# Altium project BFMC_ProcessingAllBoard.PrjPcb (part 1 of 2)
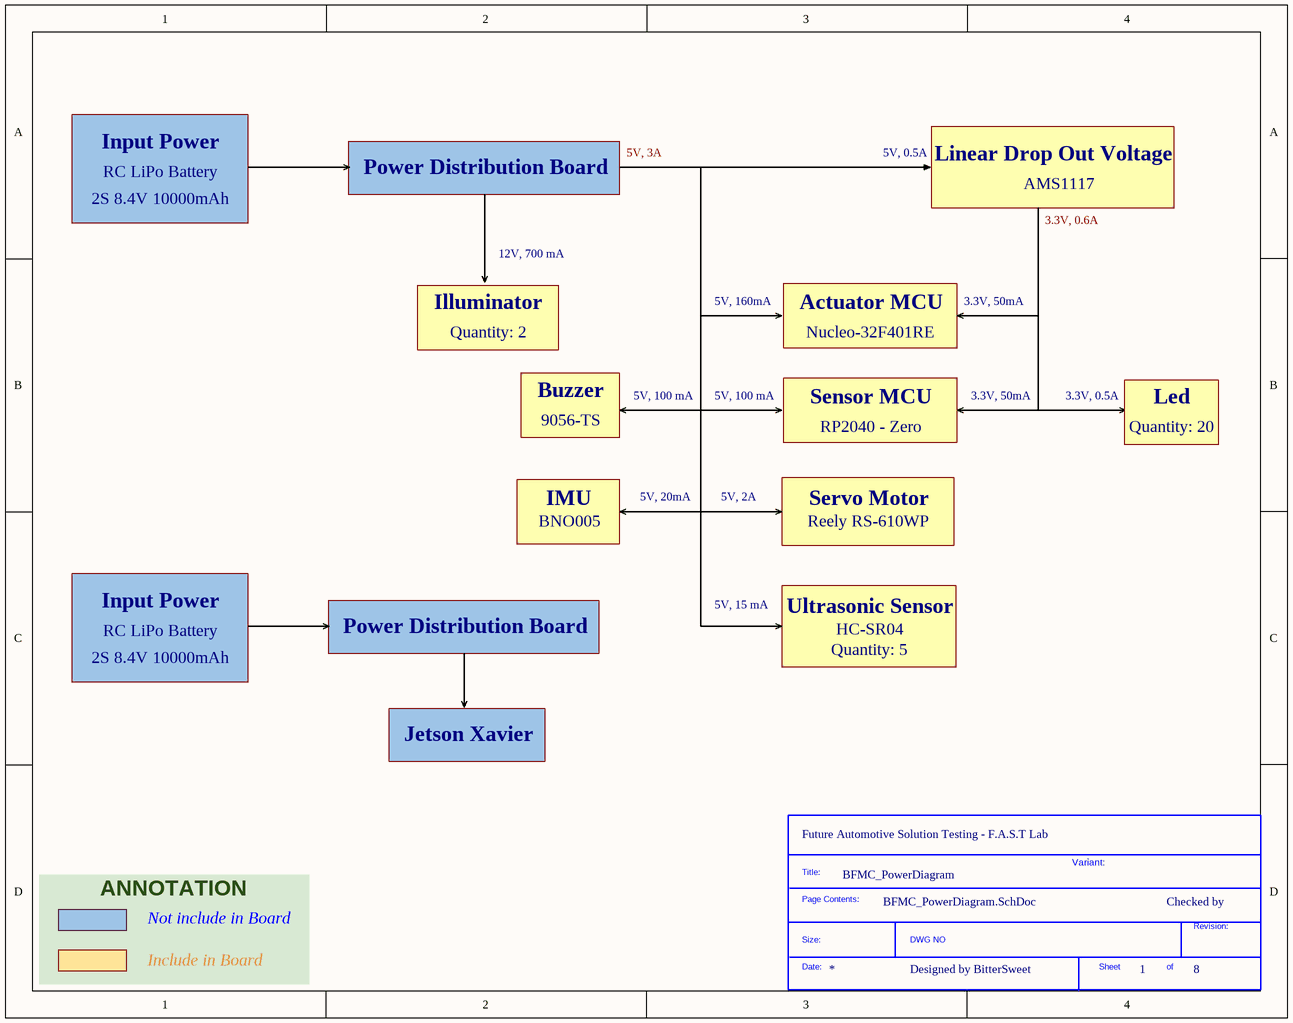
[diagram p0: BFMC_PowerDiagram.SchDoc]
7 sheets, 102 parts. Net scope: flat (ports and power ports of the same name join across sheets).
Board file: BFMC_ProcessingAllBoard.PcbDoc
Sheets:
  BFMC_PowerDiagram.SchDoc
  BFMC_SignalDiagram.SchDoc
  BFMC_FileInfo.SchDoc
  BFMC_PowerDistribution.SchDoc
  BFMC_Microcontrollers.SchDoc
  BFMC_SensorProcessing.SchDoc
  BFMC_Actuators.SchDoc

## Sheet BFMC_PowerDiagram.SchDoc
size A; SheetNumber: 1; SheetTotal: 8

### Parts
(Parts that share a designator on the sheet are numbered #1, #2 ... from top to bottom, then left to right.)
*?#1  SDTitleBlock  (value not drawn)  (graphical)

### Notes on the sheet
- Input Power
- 5V, 3A
- 5V, 0.5A
- Linear Drop Out Voltage
- 2S 8.4V 10000mAh
- RC LiPo Battery
- Power Distribution Board
- AMS1117
- 3.3V, 0.6A
- 12V, 700 mA
- Illuminator
- Quantity: 2
- 5V, 160mA
- Actuator MCU
- Nucleo-32F401RE
- 3.3V, 50mA
- Buzzer
- 9056-TS
- 5V, 100 mA
- Sensor MCU
- RP2040 - Zero
- 3.3V, 0.5A
- Quantity: 20
- Led
- IMU
- 5V, 20mA
- 5V, 2A
- Servo Motor
- BNO005
- Reely RS-610WP
- 5V, 15 mA
- Ultrasonic Sensor
- HC-SR04
- Quantity: 5
- Jetson Xavier
- (near *?#1) Future Automotive Solution Testing - F.A.S.T Lab
- BFMC_PowerDiagram
- Variant:
- Checked by
- Not include in Board
- Include in Board
- Designed by BitterSweet
- ANNOTATION
- (in symbol SDTitleBlock) Title:; Page Contents:; Revision:; Size:; DWG NO; Date:; Sheet; of

## Sheet BFMC_SignalDiagram.SchDoc
size A; SheetNumber: 2; SheetTotal: 8
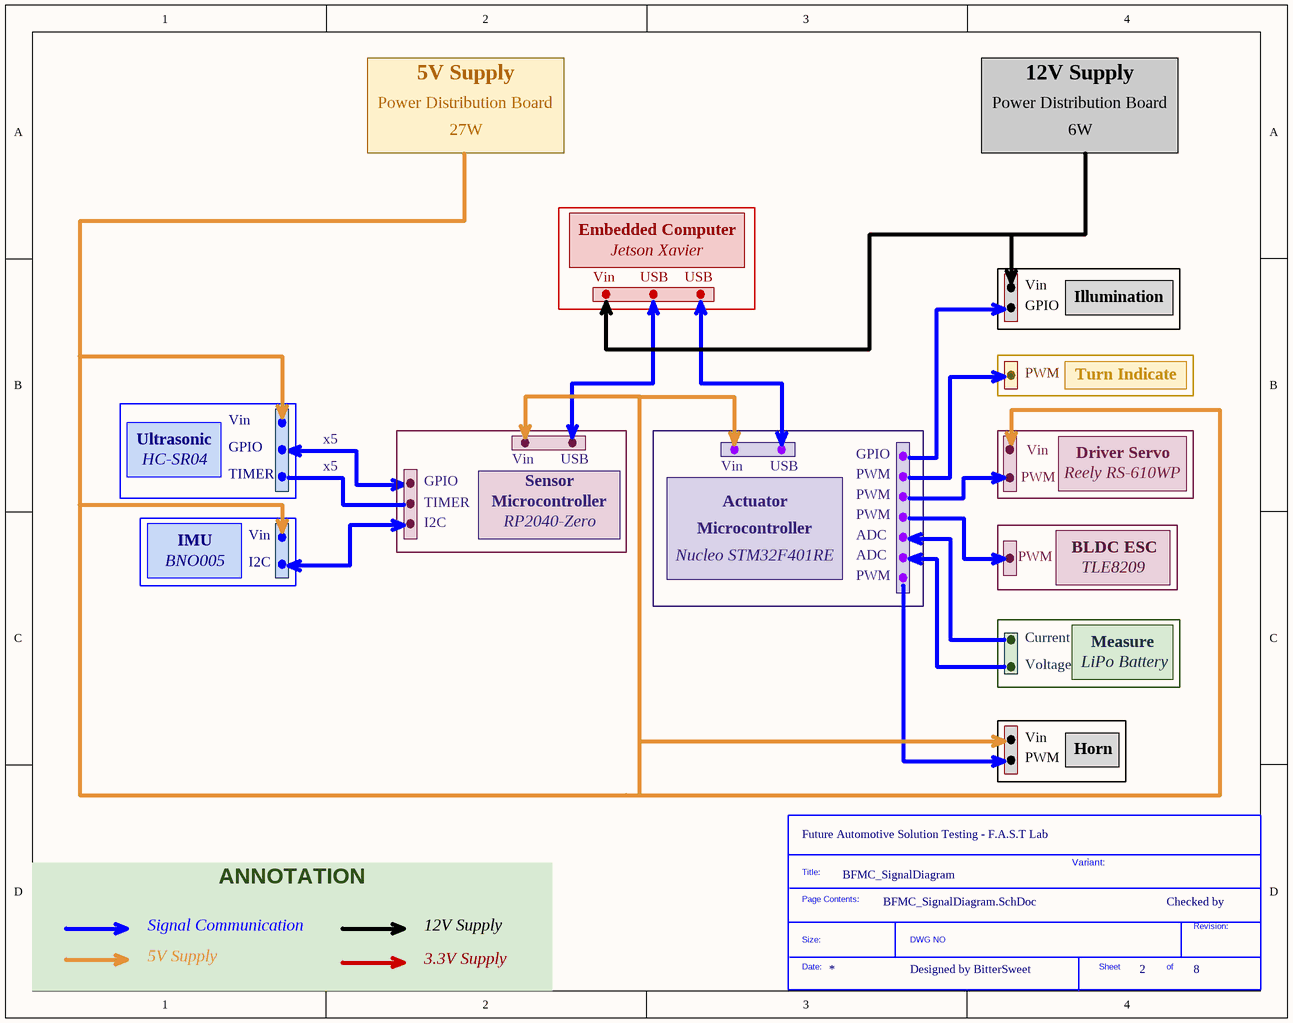
[diagram p1: BFMC_SignalDiagram.SchDoc]

### Parts
(Parts that share a designator on the sheet are numbered #1, #2 ... from top to bottom, then left to right.)
*?#2  SDTitleBlock  (value not drawn)  (graphical)

### Notes on the sheet
- 5V Supply
- 12V Supply
- Power Distribution Board
- 27W
- 6W
- Embedded Computer
- Vin
- Jetson Xavier
- USB
- Illumination
- GPIO
- PWM
- Turn Indicate
- Ultrasonic
- HC-SR04
- TIMER
- x5
- Microcontroller
- Sensor
- Actuator
- Reely RS-610WP
- Driver Servo
- BNO005
- IMU
- I2C
- RP2040-Zero
- Nucleo STM32F401RE
- ADC
- BLDC ESC
- TLE8209
- Current
- Voltage
- LiPo Battery
- Measure
- Horn
- (near *?#2) Future Automotive Solution Testing - F.A.S.T Lab
- BFMC_SignalDiagram
- Variant:
- Checked by
- Signal Communication
- 3.3V Supply
- Designed by BitterSweet
- ANNOTATION
- (in symbol SDTitleBlock) Title:; Page Contents:; Revision:; Size:; DWG NO; Date:; Sheet; of

## Sheet BFMC_FileInfo.SchDoc
size A; SheetNumber: 3; SheetTotal: 7
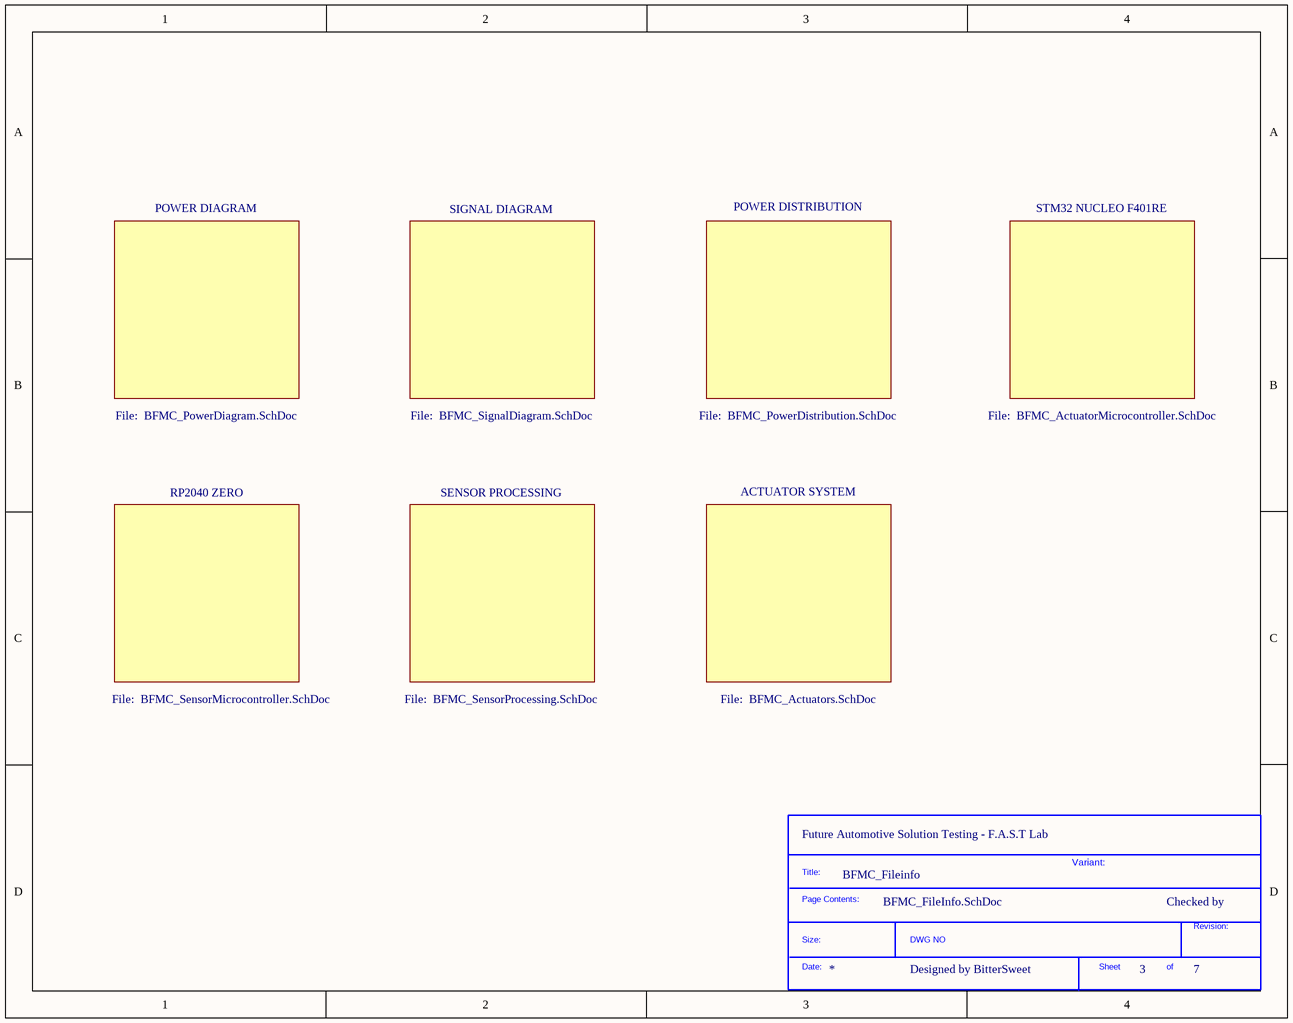
[diagram p2: BFMC_FileInfo.SchDoc]

### Parts
(Parts that share a designator on the sheet are numbered #1, #2 ... from top to bottom, then left to right.)
*?#3  SDTitleBlock  (value not drawn)  (graphical)

### Notes on the sheet
- POWER DIAGRAM
- SIGNAL DIAGRAM
- POWER DISTRIBUTION
- STM32 NUCLEO F401RE
- File:  BFMC_PowerDiagram.SchDoc
- File:  BFMC_SignalDiagram.SchDoc
- File:  BFMC_PowerDistribution.SchDoc
- File:  BFMC_ActuatorMicrocontroller.SchDoc
- RP2040 ZERO
- SENSOR PROCESSING
- ACTUATOR SYSTEM
- File:  BFMC_SensorMicrocontroller.SchDoc
- File:  BFMC_SensorProcessing.SchDoc
- File:  BFMC_Actuators.SchDoc
- (near *?#3) Future Automotive Solution Testing - F.A.S.T Lab
- BFMC_Fileinfo
- Variant:
- Checked by
- Designed by BitterSweet
- (in symbol SDTitleBlock) Title:; Page Contents:; Revision:; Size:; DWG NO; Date:; Sheet; of

## Sheet BFMC_PowerDistribution.SchDoc
size A; SheetNumber: 4; SheetTotal: 7
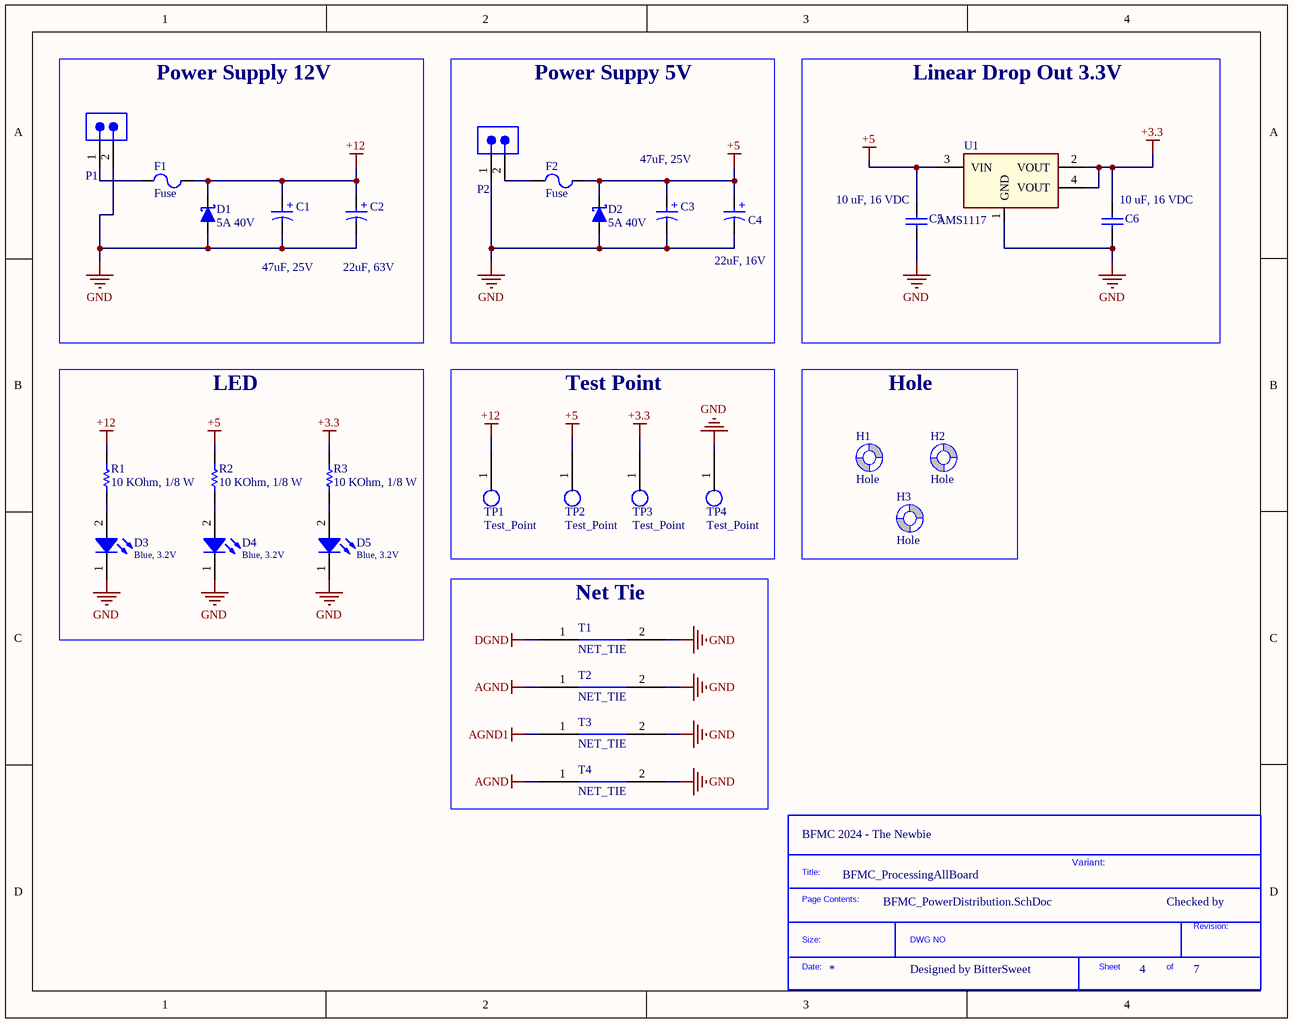
[diagram p3: BFMC_PowerDistribution.SchDoc]

### Parts
(Parts that share a designator on the sheet are numbered #1, #2 ... from top to bottom, then left to right.)
*?#4  SDTitleBlock  (value not drawn)  (graphical)
C1  47uF, 25V  [WCAP-ASLI_D6.3H5.5]
C2  22uF, 63V  [WCAP-ASLI_D6.3H7.7]
C3  47uF, 25V  [WCAP-ASLI_D6.3H5.5]
C4  22uF, 16V  [WCAP-ASLI_D4H5.5]
C5  10 uF, 16 VDC  [CAP_0805]
C6  10 uF, 16 VDC  [CAP_0805]
D1  5A 40V  [DO-214AB, SMA]
D2  5A 40V  [DO-214AB, SMA]
D3  Blue, 3.2V  [WL-SMCW_0805]
D4  Blue, 3.2V  [WL-SMCW_0805]
D5  Blue, 3.2V  [WL-SMCW_0805]
F1  Fuse  [FuseHolder1808]
F2  Fuse  [FuseHolder1808]
H1  Hole  [Hole_3.2mm]
H2  Hole  [Hole_3.2mm]
H3  Hole  [HOLE_RECTANGLE]
P1  10A, 300V  [691322310002]  (value not drawn)
P2  10A, 300V  [691322310002]  (value not drawn)
R1  10 KOhm, 1/8 W  [RESISTOR_0805]
R2  10 KOhm, 1/8 W  [RESISTOR_0805]
R3  10 KOhm, 1/8 W  [RESISTOR_0805]
T1  NET_TIE  [NET_TIE_2.0mm]
T2  NET_TIE  [NET_TIE_0.5MM]
T3  NET_TIE  [NET_TIE_0.5MM]
T4  NET_TIE  [NET_TIE_0.5MM]
TP1  Test_Point  [TP_1_5mm_SMD]
TP2  Test_Point  [TP_1_5mm_SMD]
TP3  Test_Point  [TP_1_5mm_SMD]
TP4  Test_Point  [TP_1_5mm_SMD]
U1  AMS1117  [AMS1117]

### Blocks framed on the sheet
Power Supply 12V: C1 C2 D1 F1 P1
Power Suppy 5V: C3 C4 D2 F2 P2
Linear Drop Out 3.3V: C5 C6 U1
LED: D3-D5 R1-R3
Test Point: TP1-TP4
Hole: H1-H3
Net Tie: T1-T4

### Nets
+3.3: C6.2 R3.1 TP3.1 U1.2(VOUT) U1.4(VOUT)
+5: C3.1(P) C4.1(P) C5.2 D2.2(K) F2.2 R2.1 TP2.1 U1.3(VIN)
+12: C1.1(P) C2.1(P) D1.2(K) F1.2 R1.1 TP1.1
AGND: T2.1 T4.1
AGND1: T3.1
DGND: T1.1
GND: C1.2(N) C2.2(N) C3.2(N) C4.2(N) C5.1 C6.1 D1.1(A) D2.1(A) D3.1(K) D4.1(K) D5.1(K) P1.2 P2.1 T1.2 T2.2 T3.2 T4.2 TP4.1 U1.1(GND)
NetD3_2: D3.2(A) R1.2
NetD4_2: D4.2(A) R2.2
NetD5_2: D5.2(A) R3.2
NetF1_1: F1.1 P1.1
NetF2_1: F2.1 P2.2

Not connected (* = marked no-connect by the designer): H1 1(Screw); H2 1(Screw); H3 1(Screw)

### Notes on the sheet
- (near *?#4) BFMC 2024 - The Newbie
- BFMC_ProcessingAllBoard
- Variant:
- Checked by
- Designed by BitterSweet
- (in symbol 865080340003) +
- (in symbol 865080443007) +
- (in symbol 865080745011) +
- (in symbol SDTitleBlock) Title:; Page Contents:; Revision:; Size:; DWG NO; Date:; Sheet; of

### Library data of the parts
C1 C3 = 865080443007: V-Chip, D6.3 x H5.5mm, 47uF, 25V; Manufacturer: Wurth Elektronik; Capacitance Tolerance: +/-20%; Dissipation Factor: 14%; Endurance: 2000h; Leakage Current: 11.75uA; Ripple Current: 220mA; Category: Aluminum Electrolytic Capacitors; ComponentLink2Description: Datasheet Link; ComponentLink2URL: https://www.we-online.com/redexpert/spec/865080443007?ad; Mount: Surface Mount; Operating Temperature Max: 105°C; Operating Temperature Min: -55°C; Packaging: Tape and Reel; Height: 5.5mm; Diameter: 6.3mm; Capacitance: 47uF; Rated Voltage (DC): 25V; Supplier 1 Name: Mouser; Supplier 1 SN: 710-865080443007; Supplier 1 URL: https://www.mouser.com/ProductDetail/Wurth-Elektronik/865080443007?qs=0KOYDY2FL29hh2FHnT7VZA%3D%3D; Supplier 3 Name: thegioiic; Supplier 3 URL: https://www.thegioiic.com/tu-nhom-smd-47uf-25v-6-3x5-4mm; Manufacturer Part Number: N/A; Supplier 2 Name: Digi-Key; Supplier 2 SN: N/A; Supplier 2 URL: N/A; Supplier 3 SN: N/A; Value: 47uF, 25V
C2 = 865080745011: V-Chip, D6.3 x H7.7mm, 22uF, 63V; Manufacturer: Wurth Elektronik; Capacitance Tolerance: +/-20%; Dissipation Factor: 12%; Endurance: 2000h; Leakage Current: 13.86uA; Ripple Current: 58mA; Category: Aluminum Electrolytic Capacitors; ComponentLink2Description: Datasheet Link; ComponentLink2URL: https://www.we-online.com/redexpert/spec/865080745011?ad; Mount: Surface Mount; Operating Temperature Max: 105°C; Operating Temperature Min: -55°C; Packaging: Tape and Reel; Height: 7.7mm; Diameter: 6.3mm; Capacitance: 22uF; Rated Voltage (DC): 63V; Supplier 1 Name: Mouser; Supplier 1 SN: 710-865080745011; Supplier 1 URL: https://www.mouser.vn/ProductDetail/Wurth-Elektronik/865080745011?qs=amGC7iS6iy%2FPRPUkpVJ4xg%3D%3D; Supplier 3 Name: thegioiic; Supplier 3 URL: https://www.thegioiic.com/tu-nhom-smd-22uf-63v-6-3x7-7mm; Manufacturer Part Number: N/A; Supplier 2 Name: Digi-Key; Supplier 2 SN: N/A; Supplier 2 URL: N/A; Supplier 3 SN: N/A; Value: 22uF, 63V
C4 = 865080340003: V-Chip, D4 x H5.5mm, 22uF, 16V; Manufacturer: Wurth Elektronik; Capacitance Tolerance: +/-20%; Dissipation Factor: 16%; Endurance: 2000h; Leakage Current: 3.52uA; Ripple Current: 90mA; Category: Aluminum Electrolytic Capacitors; ComponentLink2Description: Datasheet Link; ComponentLink2URL: https://www.we-online.com/redexpert/spec/865080340003?ad; Mount: Surface Mount; Operating Temperature Max: 105°C; Operating Temperature Min: -55°C; Packaging: Tape and Reel; Height: 5.5mm; Diameter: 4mm; Capacitance: 22uF; Rated Voltage (DC): 16V; Supplier 1 Name: Mouser; Supplier 1 SN: 710-865080340003; Supplier 1 URL: https://www.mouser.com/ProductDetail/Wurth-Elektronik/865080340003?qs=0KOYDY2FL2%252BowmC4S50IuQ%3D%3D; Supplier 3 Name: thegioiic; Supplier 3 URL: https://www.thegioiic.com/tu-nhom-smd-22uf-16v-4x5-4mm; Manufacturer Part Number: N/A; Supplier 2 Name: Digi-Key; Supplier 2 SN: N/A; Supplier 2 URL: N/A; Supplier 3 SN: N/A; Value: 22uF, 16V
C5 C6 = 0108051061016: CAP, size 0805, 10 uF, 16 VDC; Manufacture Name: TDK; Manufacture SN: CGA4J1X7S1C106K125AE; Capacitance: 10 uF; Tolerance: +/-10%; Voltage Rating DC: 16 VDC; ComponentLink2Description: Datasheet; ComponentLink2URL: https://product.tdk.com/system/files/dam/doc/product/capacitor/ceramic/mlcc/catalog/mlcc_automotive_soft_en.pdf?ref_disty=mouser; Operating Temperature: -55 to +125degC; Packaging: Tape and Reel; Mounting Technology: SMT; Size: 0805; Supplier 1 Name: Mouser; Supplier 1 SN: 810-CGA4J1X7S1C106KA; Supplier 1 URL: https://www.mouser.vn/ProductDetail/TDK/CGA4J1X7S1C106K125AE?qs=nQSIdc08i%252Bda5YDbrVYncg%3D%3D&utm_source=mouser-refine-download&utm_medium=file&utm_campaign=CGA4J1X7S1C106K125AE&utm_content=TDK; Supplier 2 Name: Digi-Key; Supplier 2 SN: 445-173674-2-ND; Supplier 2 URL: https://www.digikey.com/en/products/detail/tdk-corporation/cga4j1x7s1c106k125ae/5809239; Supplier 3 Name: thegioiic; Supplier 3 SN: OEM; Supplier 3 URL: https://www.thegioiic.com/tu-gom-0805-10uf-16v; Value: 10 uF, 16 VDC
D1 D2 = Diode_Schottky: SS54 SMC Diode Schottky 5A 40V; Supplier 3 URL: https://www.thegioiic.com/twgmc-ss34-sma-diode-schottky-3a
D3-D5 = 160805BlueBlur: WL-SMCW SMT Mono-color Chip LED Blur, size 0805, Blue, 3.2V, 140deg; Color: Blue; Size: 0603; Type: Blur; ComponentLink1Description: Datasheet link; ComponentLink1URL: N/A; ComponentLink2Description: Supplier 1 URL; ComponentLink2URL: https://www.mouser.vn/ProductDetail/Broadcom-Avago/HSMR-C170?qs=YDL0qNrpDT75U8LW5zK4Qg%3D%3D; ComponentLink3Description: Supplier 2 URL; ComponentLink3URL: https://www.digikey.com/en/products/detail/broadcom-limited/HSMR-C170/637706; ComponentLink4Description: Supplier 3 URL; ComponentLink4URL: N/A; Supplier 1 Name: Mouser; Supplier 1 SN: 630-HSMR-C170; Supplier 1 URL: https://www.mouser.vn/ProductDetail/Broadcom-Avago/HSMR-C170?qs=YDL0qNrpDT75U8LW5zK4Qg%3D%3D; Supplier 2 Name: Digi-Key; Supplier 2 SN: 516-1445-2-ND; Supplier 2 URL: https://www.digikey.com/en/products/detail/broadcom-limited/HSMR-C170/637706; Supplier 3 Name: ICDayRoi; Supplier 3 SN: N/A; Supplier 3 URL: https://www.thegioiic.com/led-xanh-la-0805-dan-smd-trong-suot-harvatek; Value: Blue, 3.2V
P1 P2 = 691322310002: WR-TBL Series 322 Horizontal PCB Header, THT, pitch 3.81mm, 2p; Manufacturer: Wurth Elektronik; Modularity: No; ComponentLink1Description: Datasheet Link; ComponentLink1URL: https://www.we-online.com/redexpert/spec/691322310002?ad; ComponentLink2Description: Supplier 1 URL; ComponentLink2URL: N/A; Manufacturer Part Number: 691322310002; Category: Terminal Blocks; Match Code: WR-TBL; Mount: Through Hole; Operating Temperature Max: 105°C; Operating Temperature Min: -40°C; Packaging: Box; Application: Pluggable; Number of Pins: 2; Number of Rows: 1; Orientation: Horizontal; Pitch: 3.81mm; Rated Current: 10A; Working Voltage: 300V; ComponentLink3Description: Supplier 2 URL; ComponentLink3URL: N/A; ComponentLink4Description: Supplier 3 URL; ComponentLink4URL: https://www.thegioiic.com/kf-3-81-2-r-terminal-block-plug-in-han-pcb-2-chan-cong-3-81mm-300v-10a; Supplier 1 Name: Mouser; Supplier 1 SN: N/A; Supplier 1 URL: N/A; Supplier 2 Name: Digi-Key; Supplier 2 SN: N/A; Supplier 2 URL: N/A; Supplier 3 Name: thegioiic; Supplier 3 SN: N/A; Supplier 3 URL: https://www.thegioiic.com/kf-3-81-2-r-terminal-block-plug-in-han-pcb-2-chan-cong-3-81mm-300v-10a; Value: 10A, 300V
R1-R3 = 0008051035: RES, size 0805, 10 KOhm, 1/8 W; Manufacture  Name: Vishay Dale; Manufacture  SN: CRCW080510K0JNEAC; Resistance tolerance: +/-5%; Rated Power: 1/8 W; Resistance: 10 KOhm; Size: 0805; Mounting Technology: SMT; Supplier 1 Name: Mouser; Supplier 1 SN: 71-CRCW080510K0JNEB; Supplier 1 URL: https://www.mouser.vn/ProductDetail/Vishay-Dale/CRCW080510K0JNEB?qs=LOX6nxTstiZ5fn9YUdHx5A%3D%3D; Supplier 2 Name: Digi-Key; Supplier 2 SN: 541-4163-2-ND; Supplier 2 URL: https://www.digikey.com/en/products/detail/vishay-dale/CRCW080510K0JNEAC/7928585; Supplier 3 Name: Thegioiic; Supplier 3 SN: N/A; Supplier 3 URL: https://www.thegioiic.com/dien-tro-10-kohm-0805-1-; Value: 10 KOhm, 1/8 W; ComponentLink1Description: Datasheet link; ComponentLink1URL: https://www.vishay.com/docs/28773/crcwce3.pdf; ComponentLink2Description: Supplier 1 URL; ComponentLink2URL: https://www.mouser.vn/ProductDetail/Vishay-Dale/CRCW080510K0JNEB?qs=LOX6nxTstiZ5fn9YUdHx5A%3D%3D; ComponentLink3Description: Supplier 2 URL; ComponentLink3URL: https://www.digikey.com/en/products/detail/vishay-dale/CRCW080510K0JNEAC/7928585; ComponentLink4Description: Supplier 3 URL; ComponentLink4URL: N/A
T1-T4 = NET_TIE: Straight Net Tie
U1 = AMS1117: IC Linear Drop Out 3.3V 1A SOT-223; Supplier 3 URL: https://www.thegioiic.com/ams1117-3-3v-ic-on-ap-3-3v-1a-sot-223
F1 F2 = Fuse: JLCPCB Part: *; URL: *; Supplier 3 URL: https://www.thegioiic.com/de-cau-chi-1808-dan-smd

## Sheet BFMC_Microcontrollers.SchDoc
size A; SheetNumber: 5; SheetTotal: 7
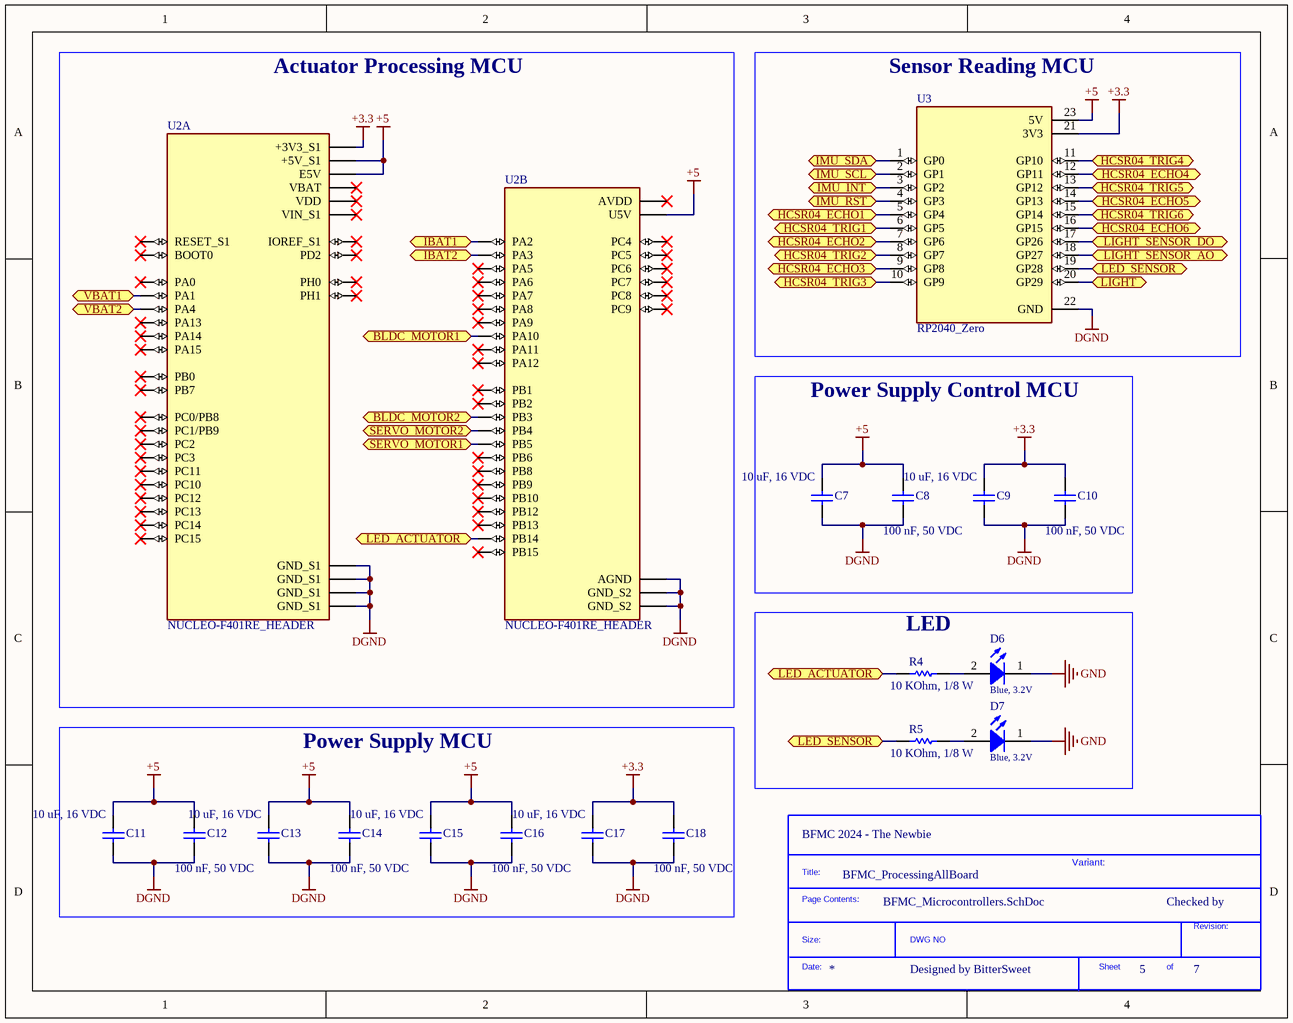
[diagram p4: BFMC_Microcontrollers.SchDoc]

### Parts
(Parts that share a designator on the sheet are numbered #1, #2 ... from top to bottom, then left to right.)
*?#5  SDTitleBlock  (value not drawn)  (graphical)
C7  10 uF, 16 VDC  [CAP_0805]
C8  100 nF, 50 VDC  [CAP_0805]
C9  10 uF, 16 VDC  [CAP_0805]
C10  100 nF, 50 VDC  [CAP_0805]
C11  10 uF, 16 VDC  [CAP_0805]
C12  100 nF, 50 VDC  [CAP_0805]
C13  10 uF, 16 VDC  [CAP_0805]
C14  100 nF, 50 VDC  [CAP_0805]
C15  10 uF, 16 VDC  [CAP_0805]
C16  100 nF, 50 VDC  [CAP_0805]
C17  10 uF, 16 VDC  [CAP_0805]
C18  100 nF, 50 VDC  [CAP_0805]
D6  Blue, 3.2V  [WL-SMCW_0805]
D7  Blue, 3.2V  [WL-SMCW_0805]
R4  10 KOhm, 1/8 W  [RESISTOR_0805]
R5  10 KOhm, 1/8 W  [RESISTOR_0805]
U2  NUCLEO-F401RE_HEADER  [NUCLEO-F401RE-HEADER]  (parts A,B of 2)
U3  RP2040_Zero  [RP2040_ZERO]

### Blocks framed on the sheet
Actuator Processing MCU: U2
Sensor Reading MCU: U3
Power Supply Control MCU: C7-C10
LED: D6 D7 R4 R5
Power Supply MCU: C11-C18

### Ports
BLDC_MOTOR1 (bidir), BLDC_MOTOR2 (bidir), HCSR04_ECHO1 (bidir), HCSR04_ECHO2 (bidir), HCSR04_ECHO3 (bidir), HCSR04_ECHO4 (bidir), HCSR04_ECHO5 (bidir), HCSR04_ECHO6 (bidir), HCSR04_TRIG1 (bidir), HCSR04_TRIG2 (bidir), HCSR04_TRIG3 (bidir), HCSR04_TRIG4 (bidir), HCSR04_TRIG5 (bidir), HCSR04_TRIG6 (bidir), IBAT1 (bidir), IBAT2 (bidir), IMU_INT (bidir), IMU_RST (bidir), IMU_SCL (bidir), IMU_SDA (bidir), LED_ACTUATOR (bidir), LED_SENSOR (bidir), LIGHT (bidir), LIGHT_SENSOR_AO (bidir), LIGHT_SENSOR_DO (bidir), SERVO_MOTOR1 (bidir), SERVO_MOTOR2 (bidir), VBAT1 (bidir), VBAT2 (bidir)

### Nets
+3.3: C9.2 C10.2 C17.2 C18.2 U2.CN7_16(+3V3_S1) U3.21(3V3)
+5: C7.2 C8.2 C11.2 C12.2 C13.2 C14.2 C15.2 C16.2 U2.CN7_6(E5V) U2.CN7_18(+5V_S1) U2.CN10_8(U5V) U3.23(5V)
DGND: C7.1 C8.1 C9.1 C10.1 C11.1 C12.1 C13.1 C14.1 C15.1 C16.1 C17.1 C18.1 U2.CN7_8(GND_S1) U2.CN7_19(GND_S1) U2.CN7_20(GND_S1) U2.CN7_22(GND_S1) U2.CN10_9(GND_S2) U2.CN10_20(GND_S2) U2.CN10_32(AGND) U3.22(GND)
GND: D6.1(K) D7.1(K)
NetC35_2: U3.18(GP27) ; port LIGHT_SENSOR_AO
NetD6_2: D6.2(A) R4.2
NetD7_2: D7.2(A) R5.2
NetP3_1: U3.1(GP0) ; port IMU_SDA
NetP3_2: U3.2(GP1) ; port IMU_SCL
NetP3_4: U3.3(GP2) ; port IMU_INT
NetP3_5: U3.4(GP3) ; port IMU_RST
NetP4_2: U3.6(GP5) ; port HCSR04_TRIG1
NetP4_3: U3.5(GP4) ; port HCSR04_ECHO1
NetP5_2: U3.7(GP6) ; port HCSR04_ECHO2
NetP5_3: U3.8(GP7) ; port HCSR04_TRIG2
NetP6_2: U3.10(GP9) ; port HCSR04_TRIG3
NetP6_3: U3.9(GP8) ; port HCSR04_ECHO3
NetP7_3: U3.17(GP26) ; port LIGHT_SENSOR_DO
NetP8_2: U3.11(GP10) ; port HCSR04_TRIG4
NetP8_3: U3.12(GP11) ; port HCSR04_ECHO4
NetP9_2: U3.13(GP12) ; port HCSR04_TRIG5
NetP9_3: U3.14(GP13) ; port HCSR04_ECHO5
NetP10_2: U3.15(GP14) ; port HCSR04_TRIG6
NetP10_3: U3.16(GP15) ; port HCSR04_ECHO6
NetP15_1: U2.CN10_33(PA10) ; port BLDC_MOTOR1
NetP16_1: U2.CN10_35(PA2) ; port IBAT1
NetP17_2: U2.CN10_31(PB3) ; port BLDC_MOTOR2
NetP18_2: U2.CN10_37(PA3) ; port IBAT2
NetP19_1: U2.CN10_29(PB5) ; port SERVO_MOTOR1
NetP20_1: U2.CN7_30(PA1) ; port VBAT1
NetP21_2: U2.CN10_27(PB4) ; port SERVO_MOTOR2
NetP22_2: U2.CN7_32(PA4) ; port VBAT2
NetR4_1: R4.1 U2.CN10_28(PB14) ; port LED_ACTUATOR
NetR5_1: R5.1 U3.19(GP28) ; port LED_SENSOR
NetR7_1: U3.20(GP29) ; port LIGHT

Not connected (* = marked no-connect by the designer): U2 CN7_1(PC10)* CN7_2(PC11)* CN7_3(PC12)* CN7_4(PD2)* CN7_5(VDD)* CN7_7(BOOT0)* CN7_12(IOREF_S1)* CN7_13(PA13)* CN7_14(RESET_S1)* CN7_15(PA14)* CN7_17(PA15)* CN7_21(PB7)* CN7_23(PC13)* CN7_24(VIN_S1)* CN7_25(PC14)* CN7_27(PC15)* CN7_28(PA0)* CN7_29(PH0)* CN7_31(PH1)* CN7_33(VBAT)* CN7_34(PB0)* CN7_35(PC2)* CN7_36(PC1/PB9)* CN7_37(PC3)* CN7_38(PC0/PB8)* CN10_1(PC9)* CN10_2(PC8)* CN10_3(PB8)* CN10_4(PC6)* CN10_5(PB9)* CN10_6(PC5)* CN10_7(AVDD)* CN10_11(PA5)* CN10_12(PA12)* CN10_13(PA6)* CN10_14(PA11)* CN10_15(PA7)* CN10_16(PB12)* CN10_17(PB6)* CN10_19(PC7)* CN10_21(PA9)* CN10_22(PB2)* CN10_23(PA8)* CN10_24(PB1)* CN10_25(PB10)* CN10_26(PB15)* CN10_30(PB13)* CN10_34(PC4)*

### Notes on the sheet
- (near *?#5) BFMC 2024 - The Newbie
- BFMC_ProcessingAllBoard
- Variant:
- Checked by
- Designed by BitterSweet
- (in symbol SDTitleBlock) Title:; Page Contents:; Revision:; Size:; DWG NO; Date:; Sheet; of

### Library data of the parts
C7 C9 C11 C13 C15 C17 = 0108051061016: as C5 on sheet BFMC_PowerDistribution; ComponentLink2Description: Datasheet; ComponentLink2URL: https://product.tdk.com/system/files/dam/doc/product/capacitor/ceramic/mlcc/catalog/mlcc_automotive_soft_en.pdf?ref_disty=mouser; Operating Temperature: -55 to +125degC; Packaging: Tape and Reel; Mounting Technology: SMT; Size: 0805; Supplier 1 Name: Mouser; Supplier 1 SN: 810-CGA4J1X7S1C106KA; Supplier 1 URL: https://www.mouser.vn/ProductDetail/TDK/CGA4J1X7S1C106K125AE?qs=nQSIdc08i%252Bda5YDbrVYncg%3D%3D&utm_source=mouser-refine-download&utm_medium=file&utm_campaign=CGA4J1X7S1C106K125AE&utm_content=TDK; Supplier 2 Name: Digi-Key; Supplier 2 SN: 445-173674-2-ND; Supplier 2 URL: https://www.digikey.com/en/products/detail/tdk-corporation/cga4j1x7s1c106k125ae/5809239; Supplier 3 Name: thegioiic; Supplier 3 SN: OEM; Supplier 3 URL: https://www.thegioiic.com/tu-gom-0805-10uf-16v; Value: 10 uF, 16 VDC
C8 C10 C12 C14 C16 C18 = 0108051031050: CAP, size 0805, 100 nF, 50 VDC; Manufacture Name: TDK; Manufacture SN: CGA4C2C0G1H103J060AA; Capacitance: 100 nF; Tolerance: +/-5%; Voltage Rating DC: 50 VDC; ComponentLink2Description: Datasheet; ComponentLink2URL: https://product.tdk.com/system/files/dam/doc/product/capacitor/ceramic/mlcc/catalog/mlcc_automotive_general_en.pdf?ref_disty=mouser; Operating Temperature: -55 to +125degC; Packaging: Tape and Reel; Mounting Technology: SMT; Size: 0805; Supplier 1 Name: Mouser; Supplier 1 SN: 810-CGA4C2C0G1H103J; Supplier 1 URL: https://www.mouser.vn/ProductDetail/TDK/CGA4C2C0G1H103J060AA?qs=FxQuwy19cyC9M6v0nMqjhA%3D%3D&utm_source=mouser-refine-download&utm_medium=file&utm_campaign=CGA4C2C0G1H103J060AA&utm_content=TDK; Supplier 2 Name: Digi-Key; Supplier 2 SN: 445-6947-2-ND; Supplier 2 URL: https://www.digikey.com/en/products/detail/tdk-corporation/cga4c2c0g1h103j060aa/2672840; Supplier 3 Name: thegioiic; Supplier 3 SN: OEM; Supplier 3 URL: https://www.thegioiic.com/tu-gom-0805-100nf-0-1uf-50v; Value: 100 nF, 50 VDC
D6 D7 = 160805BlueBlur: as D3 on sheet BFMC_PowerDistribution; Color: Blue; Size: 0603; Type: Blur; ComponentLink1Description: Datasheet link; ComponentLink1URL: N/A; ComponentLink2Description: Supplier 1 URL; ComponentLink2URL: https://www.mouser.vn/ProductDetail/Broadcom-Avago/HSMR-C170?qs=YDL0qNrpDT75U8LW5zK4Qg%3D%3D; ComponentLink3Description: Supplier 2 URL; ComponentLink3URL: https://www.digikey.com/en/products/detail/broadcom-limited/HSMR-C170/637706; ComponentLink4Description: Supplier 3 URL; ComponentLink4URL: N/A; Supplier 1 Name: Mouser; Supplier 1 SN: 630-HSMR-C170; Supplier 1 URL: https://www.mouser.vn/ProductDetail/Broadcom-Avago/HSMR-C170?qs=YDL0qNrpDT75U8LW5zK4Qg%3D%3D; Supplier 2 Name: Digi-Key; Supplier 2 SN: 516-1445-2-ND; Supplier 2 URL: https://www.digikey.com/en/products/detail/broadcom-limited/HSMR-C170/637706; Supplier 3 Name: ICDayRoi; Supplier 3 SN: N/A; Value: Blue, 3.2V
  D6: Supplier 3 URL: https://www.thegioiic.com/led-trang-0805-dan-smd-trong-suot-harvatek
  D7: Supplier 3 URL: https://www.thegioiic.com/led-xanh-duong-0805-dan-smd-trong-suot-harvatek
R4 R5 = 0008051035: as R1 on sheet BFMC_PowerDistribution; Size: 0805; Mounting Technology: SMT; Supplier 1 Name: Mouser; Supplier 1 SN: 71-CRCW080510K0JNEB; Supplier 1 URL: https://www.mouser.vn/ProductDetail/Vishay-Dale/CRCW080510K0JNEB?qs=LOX6nxTstiZ5fn9YUdHx5A%3D%3D; Supplier 2 Name: Digi-Key; Supplier 2 SN: 541-4163-2-ND; Supplier 2 URL: https://www.digikey.com/en/products/detail/vishay-dale/CRCW080510K0JNEAC/7928585; Supplier 3 Name: Thegioiic; Supplier 3 SN: N/A; Supplier 3 URL: https://www.thegioiic.com/dien-tro-10-kohm-0805-1-; Value: 10 KOhm, 1/8 W; ComponentLink1Description: Datasheet link; ComponentLink1URL: https://www.vishay.com/docs/28773/crcwce3.pdf; ComponentLink2Description: Supplier 1 URL; ComponentLink2URL: https://www.mouser.vn/ProductDetail/Vishay-Dale/CRCW080510K0JNEB?qs=LOX6nxTstiZ5fn9YUdHx5A%3D%3D; ComponentLink3Description: Supplier 2 URL; ComponentLink3URL: https://www.digikey.com/en/products/detail/vishay-dale/CRCW080510K0JNEAC/7928585; ComponentLink4Description: Supplier 3 URL; ComponentLink4URL: N/A
U2 = NUCLEO-F401RE_HEADER: STM32 Nucleo-64 development board with STM32F401RET6 MCU, supports Arduino and ST morpho connectivity; Availability: Unavailable; Price: None; Package: None; MP: NUCLEO-F401RE; Value: *
U3 = RP2040_ZERO: RP2040-Zero, A Low-Cost, High-Performance Pico-Like MCU Board Based On Raspberry Pi Microcontroller RP2040

## Sheet BFMC_SensorProcessing.SchDoc
size A; SheetNumber: 6; SheetTotal: 7
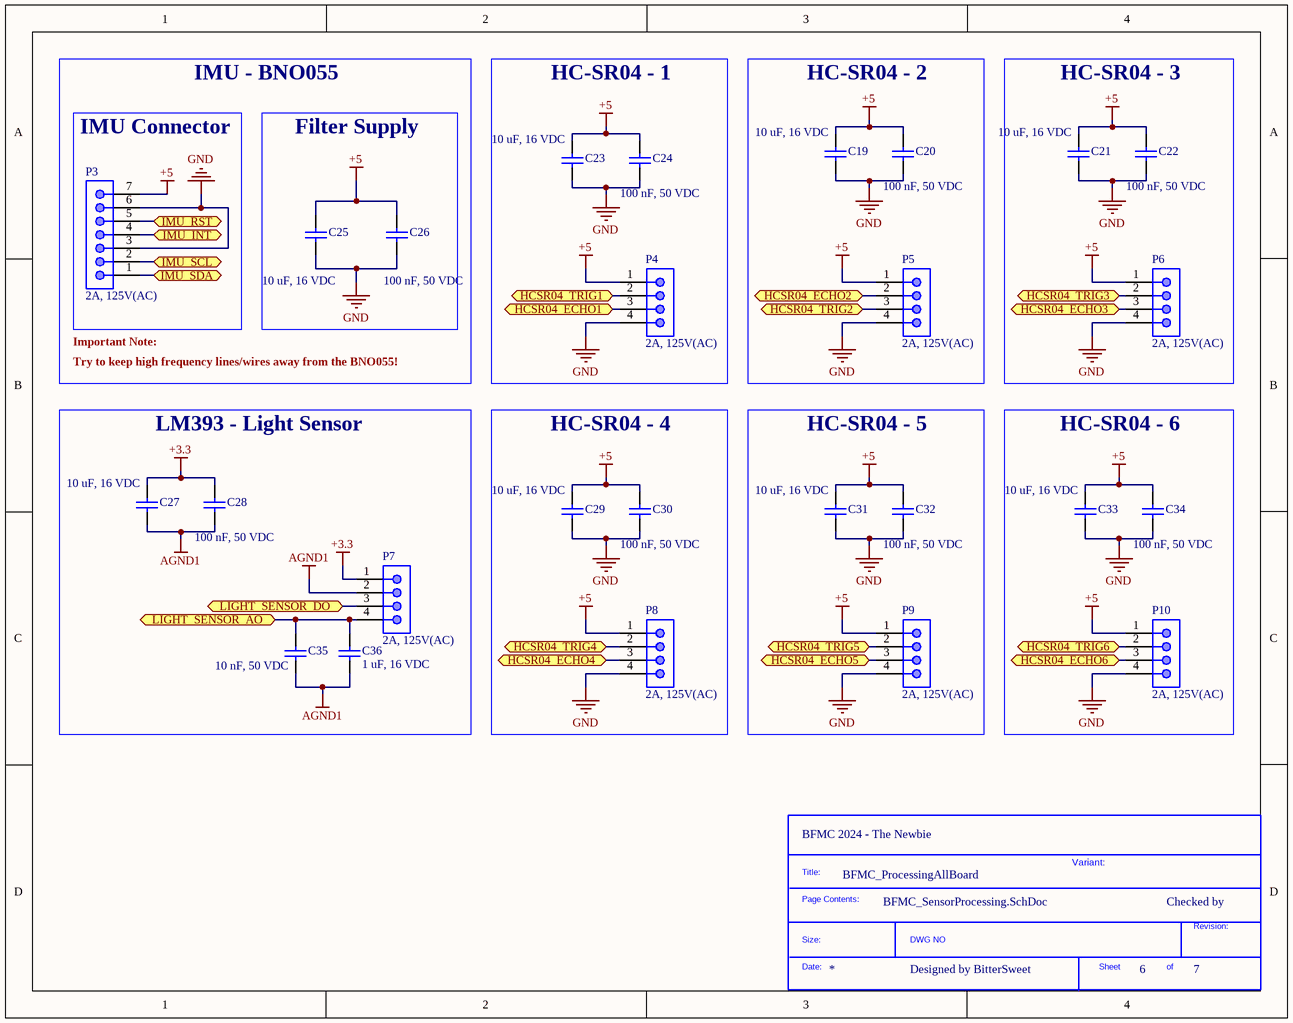
[diagram p5: BFMC_SensorProcessing.SchDoc]

### Parts
(Parts that share a designator on the sheet are numbered #1, #2 ... from top to bottom, then left to right.)
*?#6  SDTitleBlock  (value not drawn)  (graphical)
C19  10 uF, 16 VDC  [CAP_0805]
C20  100 nF, 50 VDC  [CAP_0805]
C21  10 uF, 16 VDC  [CAP_0805]
C22  100 nF, 50 VDC  [CAP_0805]
C23  10 uF, 16 VDC  [CAP_0805]
C24  100 nF, 50 VDC  [CAP_0805]
C25  10 uF, 16 VDC  [CAP_0805]
C26  100 nF, 50 VDC  [CAP_0805]
C27  10 uF, 16 VDC  [CAP_0805]
C28  100 nF, 50 VDC  [CAP_0805]
C29  10 uF, 16 VDC  [CAP_0805]
C30  100 nF, 50 VDC  [CAP_0805]
C31  10 uF, 16 VDC  [CAP_0805]
C32  100 nF, 50 VDC  [CAP_0805]
C33  10 uF, 16 VDC  [CAP_0805]
C34  100 nF, 50 VDC  [CAP_0805]
C35  10 nF, 50 VDC  [CAP_0805]
C36  1 uF, 16 VDC  [CAP_0805]
P3  2A, 125V(AC)  [620107131822]
P4  2A, 125V(AC)  [620104131822]
P5  2A, 125V(AC)  [620104131822]
P6  2A, 125V(AC)  [620104131822]
P7  2A, 125V(AC)  [620304124022]
P8  2A, 125V(AC)  [620104131822]
P9  2A, 125V(AC)  [620104131822]
P10  2A, 125V(AC)  [620104131822]

### Blocks framed on the sheet
HC-SR04 - 1: C23 C24 P4
HC-SR04 - 2: C19 C20 P5
HC-SR04 - 3: C21 C22 P6
IMU Connector: P3
Filter Supply: C25 C26
LM393 - Light Sensor: C27 C28 C35 C36 P7
HC-SR04 - 4: C29 C30 P8
HC-SR04 - 5: C31 C32 P9
HC-SR04 - 6: C33 C34 P10

### Ports
HCSR04_ECHO1 (bidir), HCSR04_ECHO2 (bidir), HCSR04_ECHO3 (bidir), HCSR04_ECHO4 (bidir), HCSR04_ECHO5 (bidir), HCSR04_ECHO6 (bidir), HCSR04_TRIG1 (bidir), HCSR04_TRIG2 (bidir), HCSR04_TRIG3 (bidir), HCSR04_TRIG4 (bidir), HCSR04_TRIG5 (bidir), HCSR04_TRIG6 (bidir), IMU_INT (bidir), IMU_RST (bidir), IMU_SCL (bidir), IMU_SDA (bidir), LIGHT_SENSOR_AO (bidir), LIGHT_SENSOR_DO (bidir)

### Nets
+3.3: C27.2 C28.2 P7.1
+5: C19.2 C20.2 C21.2 C22.2 C23.2 C24.2 C25.2 C26.2 C29.2 C30.2 C31.2 C32.2 C33.2 C34.2 P3.7 P4.1 P5.1 P6.1 P8.1 P9.1 P10.1
AGND1: C27.1 C28.1 C35.1 C36.1 P7.2
GND: C19.1 C20.1 C21.1 C22.1 C23.1 C24.1 C25.1 C26.1 C29.1 C30.1 C31.1 C32.1 C33.1 C34.1 P3.3 P3.6 P4.4 P5.4 P6.4 P8.4 P9.4 P10.4
NetC35_2: C35.2 C36.2 P7.4 ; port LIGHT_SENSOR_AO
NetP3_1: P3.1 ; port IMU_SDA
NetP3_2: P3.2 ; port IMU_SCL
NetP3_4: P3.4 ; port IMU_INT
NetP3_5: P3.5 ; port IMU_RST
NetP4_2: P4.2 ; port HCSR04_TRIG1
NetP4_3: P4.3 ; port HCSR04_ECHO1
NetP5_2: P5.2 ; port HCSR04_ECHO2
NetP5_3: P5.3 ; port HCSR04_TRIG2
NetP6_2: P6.2 ; port HCSR04_TRIG3
NetP6_3: P6.3 ; port HCSR04_ECHO3
NetP7_3: P7.3 ; port LIGHT_SENSOR_DO
NetP8_2: P8.2 ; port HCSR04_TRIG4
NetP8_3: P8.3 ; port HCSR04_ECHO4
NetP9_2: P9.2 ; port HCSR04_TRIG5
NetP9_3: P9.3 ; port HCSR04_ECHO5
NetP10_2: P10.2 ; port HCSR04_TRIG6
NetP10_3: P10.3 ; port HCSR04_ECHO6

### Notes on the sheet
- IMU - BNO055
- Important Note:
- Try to keep high frequency lines/wires away from the BNO055!
- (near *?#6) BFMC 2024 - The Newbie
- BFMC_ProcessingAllBoard
- Variant:
- Checked by
- Designed by BitterSweet
- (in symbol SDTitleBlock) Title:; Page Contents:; Revision:; Size:; DWG NO; Date:; Sheet; of

### Library data of the parts
C19 C21 C23 C25 C27 C29 C31 C33 = 0108051061016: as C5 on sheet BFMC_PowerDistribution; ComponentLink2Description: Datasheet; ComponentLink2URL: https://product.tdk.com/system/files/dam/doc/product/capacitor/ceramic/mlcc/catalog/mlcc_automotive_soft_en.pdf?ref_disty=mouser; Operating Temperature: -55 to +125degC; Packaging: Tape and Reel; Mounting Technology: SMT; Size: 0805; Supplier 1 Name: Mouser; Supplier 1 SN: 810-CGA4J1X7S1C106KA; Supplier 1 URL: https://www.mouser.vn/ProductDetail/TDK/CGA4J1X7S1C106K125AE?qs=nQSIdc08i%252Bda5YDbrVYncg%3D%3D&utm_source=mouser-refine-download&utm_medium=file&utm_campaign=CGA4J1X7S1C106K125AE&utm_content=TDK; Supplier 2 Name: Digi-Key; Supplier 2 SN: 445-173674-2-ND; Supplier 2 URL: https://www.digikey.com/en/products/detail/tdk-corporation/cga4j1x7s1c106k125ae/5809239; Supplier 3 Name: thegioiic; Supplier 3 SN: OEM; Supplier 3 URL: https://www.thegioiic.com/tu-gom-0805-10uf-16v; Value: 10 uF, 16 VDC
C20 C22 C24 C26 C28 C30 C32 C34 = 0108051031050: as C8 on sheet BFMC_Microcontrollers; ComponentLink2Description: Datasheet; ComponentLink2URL: https://product.tdk.com/system/files/dam/doc/product/capacitor/ceramic/mlcc/catalog/mlcc_automotive_general_en.pdf?ref_disty=mouser; Operating Temperature: -55 to +125degC; Packaging: Tape and Reel; Mounting Technology: SMT; Size: 0805; Supplier 1 Name: Mouser; Supplier 1 SN: 810-CGA4C2C0G1H103J; Supplier 1 URL: https://www.mouser.vn/ProductDetail/TDK/CGA4C2C0G1H103J060AA?qs=FxQuwy19cyC9M6v0nMqjhA%3D%3D&utm_source=mouser-refine-download&utm_medium=file&utm_campaign=CGA4C2C0G1H103J060AA&utm_content=TDK; Supplier 2 Name: Digi-Key; Supplier 2 SN: 445-6947-2-ND; Supplier 2 URL: https://www.digikey.com/en/products/detail/tdk-corporation/cga4c2c0g1h103j060aa/2672840; Supplier 3 Name: thegioiic; Supplier 3 SN: OEM; Supplier 3 URL: https://www.thegioiic.com/tu-gom-0805-100nf-0-1uf-50v; Value: 100 nF, 50 VDC
C35 = 0108051031050: CAP, size 0805, 10 nF, 50 VDC; Manufacture Name: TDK; Manufacture SN: CGA4C2C0G1H103J060AA; Capacitance: 10 nF; Tolerance: +/-5%; Voltage Rating DC: 50 VDC; ComponentLink2Description: Datasheet; ComponentLink2URL: https://product.tdk.com/system/files/dam/doc/product/capacitor/ceramic/mlcc/catalog/mlcc_automotive_general_en.pdf?ref_disty=mouser; Operating Temperature: -55 to +125degC; Packaging: Tape and Reel; Mounting Technology: SMT; Size: 0805; Supplier 1 Name: Mouser; Supplier 1 SN: 810-CGA4C2C0G1H103J; Supplier 1 URL: https://www.mouser.vn/ProductDetail/TDK/CGA4C2C0G1H103J060AA?qs=FxQuwy19cyC9M6v0nMqjhA%3D%3D&utm_source=mouser-refine-download&utm_medium=file&utm_campaign=CGA4C2C0G1H103J060AA&utm_content=TDK; Supplier 2 Name: Digi-Key; Supplier 2 SN: 445-6947-2-ND; Supplier 2 URL: https://www.digikey.com/en/products/detail/tdk-corporation/cga4c2c0g1h103j060aa/2672840; Supplier 3 Name: thegioiic; Supplier 3 SN: OEM; Supplier 3 URL: https://www.thegioiic.com/tu-gom-0805-10nf-50v; Value: 10 nF, 50 VDC
C36 = 0108051051016: CAP, size 0805, 1 uF, 16 VDC; Manufacture Name: TDK; Manufacture SN: CGA4J2X7R1C105K125AA; Capacitance: 1 uF; Tolerance: +/-10%; Voltage Rating DC: 16 VDC; ComponentLink2Description: Datasheet; ComponentLink2URL: https://product.tdk.com/system/files/dam/doc/product/capacitor/ceramic/mlcc/catalog/mlcc_automotive_general_en.pdf?ref_disty=mouser; Operating Temperature: -55 to +125degC; Packaging: Tape and Reel; Mounting Technology: SMT; Size: 0805; Supplier 1 Name: Mouser; Supplier 1 SN: 810-CGA4J2X7R1C105K; Supplier 1 URL: https://www.mouser.vn/ProductDetail/TDK/CGA4J2X7R1C105K125AA?qs=NRhsANhppD8sFjo%252B1TQuCQ%3D%3D&utm_source=mouser-refine-download&utm_medium=file&utm_campaign=CGA4J2X7R1C105K125AA&utm_content=TDK; Supplier 2 Name: Digi-Key; Supplier 2 SN: 445-5689-2-ND; Supplier 2 URL: https://www.digikey.com/en/products/detail/tdk-corporation/cga4j2x7r1c105k125aa/2443167; Supplier 3 Name: thegioiic; Supplier 3 SN: OEM; Supplier 3 URL: https://www.thegioiic.com/tu-gom-0805-1uf-16v; Value: 1 uF, 16 VDC
P3 = 620107131822: WR-WTB SMT Male Horizontal Shrouded Header, pitch 2mm, 7p; Pin Number: 7; Contact Resistance: 20mOhm; Withstanding Voltage: 800VAC; Working Voltage: 100VAC; ComponentLink1Description: Manufacturer; ComponentLink1URL: http://www.we-online.de; ComponentLink2Description: Datasheet; ComponentLink2URL: https://www.we-online.com/catalog/datasheet/620107131822.pdf; Pitch: 2mm; Published Date: January 2020; Publisher: Wurth Elektronik; Mounting Technology: SMT; Packaging: Tape and Reel; Operating Temperature: -25 to +85degC; Part Number: 620107131822; Gender: Male; Type: Horizontal; Rated Current: 2A; ComponentLink3Description: Global Supply; ComponentLink3URL: https://www.we-online.com/en/components/products/WTB_2_00_SMT_MALE_HORIZONTAL_SHROUDED_HEADER_6201XX131822?sq=620107131822#620107131822; Supplier 1 Name: Mouser; Supplier 1 SN: N/A; Supplier 1 URL: N/A; Supplier 2 Name: Digi-Key; Supplier 2 SN: N/A; Supplier 2 URL: N/A; Supplier 3 Name: thegioiic; Supplier 3 SN: N/A; Supplier 3 URL: https://www.thegioiic.com/dau-ph2-0mm-7-chan-dan-smd-nam-ngang; Value: 2A, 125V(AC)
P4-P6 P8-P10 = 620104131822: WR-WTB SMT Male Horizontal Shrouded Header, pitch 2mm, 4p; Pin Number: 4; Contact Resistance: 20mOhm; Withstanding Voltage: 800VAC; Working Voltage: 100VAC; ComponentLink1Description: Manufacturer; ComponentLink1URL: http://www.we-online.de; ComponentLink2Description: Datasheet; ComponentLink2URL: https://www.we-online.com/catalog/datasheet/620104131822.pdf; Pitch: 2mm; Published Date: January 2020; Publisher: Wurth Elektronik; Mounting Technology: SMT; Packaging: Tape and Reel; Operating Temperature: -25 to +85degC; Part Number: 620104131822; Gender: Male; Type: Horizontal; Rated Current: 2A; ComponentLink3Description: Global Supply; ComponentLink3URL: https://www.we-online.com/en/components/products/WTB_2_00_SMT_MALE_HORIZONTAL_SHROUDED_HEADER_6201XX131822?sq=620104131822#620104131822; ComponentLink4Description: Global Supply; ComponentLink4URL: https://www.mouser.vn/ProductDetail/Wurth-Elektronik/620104131822?qs=ZtY9WdtwX57A7D%2FbILyVEQ%3D%3D; Supplier 1 Name: Mouser; Supplier 1 SN: 710-620104131822; Supplier 1 URL: https://www.mouser.vn/ProductDetail/Wurth-Elektronik/620104131822?qs=ZtY9WdtwX57A7D%2FbILyVEQ%3D%3D; Supplier 2 Name: Digi-Key; Supplier 2 SN: N/A; Supplier 2 URL: N/A; Supplier 3 Name: thegioiic; Supplier 3 SN: N/A; Supplier 3 URL: https://www.thegioiic.com/dau-ph2-0mm-4-chan-dan-smd-nam-ngang; Value: 2A, 125V(AC)
P7 = 620304124022: WR-WTB SMT Male Vertical Shrouded Header, pitch 2mm, 4p; Pin Number: 4; Contact Resistance: 20mOhm; Withstanding Voltage: 800VAC; Working Voltage: 100VAC; ComponentLink1Description: Manufacturer; ComponentLink1URL: http://www.we-online.de; ComponentLink2Description: Datasheet; ComponentLink2URL: https://www.we-online.com/catalog/datasheet/620304124022.pdf; Pitch: 2mm; Published Date: January 2020; Publisher: Wurth Elektronik; Mounting Technology: SMT; Packaging: Tape and Reel; Operating Temperature: -25 to +85degC; Part Number: 620304124022; Gender: Male; Type: Vertical; Rated Current: 2A; ComponentLink3Description: Global Supply; ComponentLink3URL: https://www.we-online.com/en/components/products/WTB_2_00_SMT_MALE_VERTICAL_SHROUDED_HEADER_6203XX124022?sq=620304124022#620304124022; ComponentLink4Description: Global Supply; ComponentLink4URL: https://www.mouser.vn/ProductDetail/Wurth-Elektronik/620304124022?qs=ZtY9WdtwX5729BhN8GzI6w%3D%3D; Supplier 1 Name: Mouser; Supplier 1 SN: 710-620304124022; Supplier 1 URL: https://www.mouser.vn/ProductDetail/Wurth-Elektronik/620304124022?qs=ZtY9WdtwX5729BhN8GzI6w%3D%3D; Supplier 2 Name: Digi-Key; Supplier 2 SN: N/A; Supplier 2 URL: N/A; Supplier 3 Name: thegioiic; Supplier 3 SN: N/A; Supplier 3 URL: https://www.thegioiic.com/dau-hy2-0mm-4-chan-dan-smd-thang-dung; Value: 2A, 125V(AC)

## Sheet BFMC_Actuators.SchDoc
size A; SheetNumber: 7; SheetTotal: 7
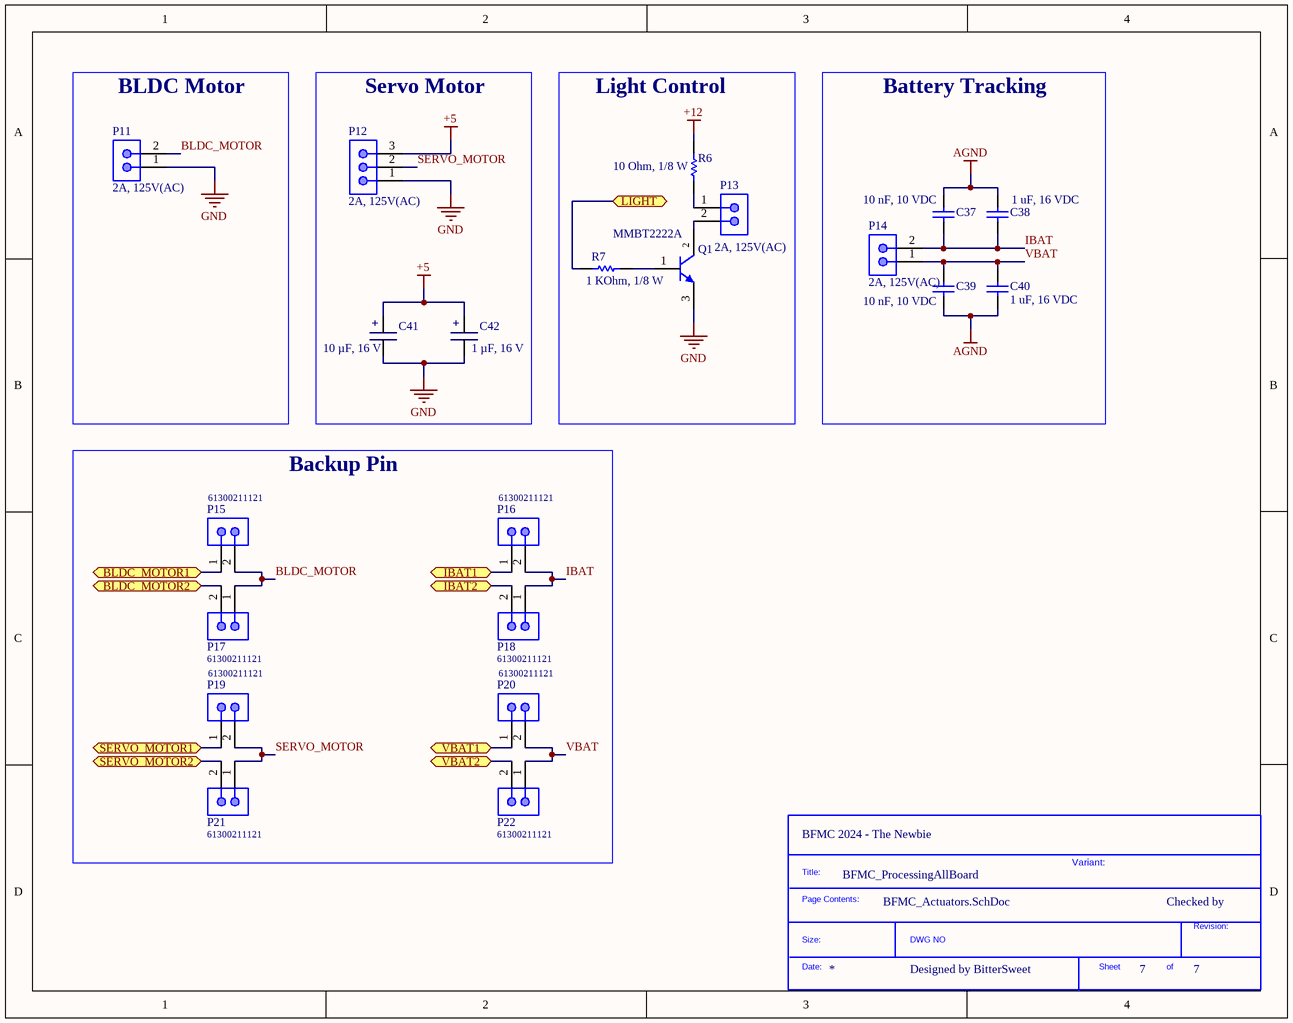
[diagram p6: BFMC_Actuators.SchDoc]

### Parts
(Parts that share a designator on the sheet are numbered #1, #2 ... from top to bottom, then left to right.)
*?#7  SDTitleBlock  (value not drawn)  (graphical)
C37  10 nF, 10 VDC  [CAP_0603]
C38  1 uF, 16 VDC  [CAP_0603]
C39  10 nF, 10 VDC  [CAP_0603]
C40  1 uF, 16 VDC  [CAP_0603]
C41  10 µF, 16 V  [TANTALUM SMD A]
C42  1 µF, 16 V  [TANTALUM SMD A]
P11  2A, 125V(AC)  [620102131822]
P12  2A, 125V(AC)  [620103131822]
P13  2A, 125V(AC)  [620302124022]
P14  2A, 125V(AC)  [620102131822]
P15  61300211121  [61300211121]
P16  61300211121  [61300211121]
P17  61300211121  [61300211121]
P18  61300211121  [61300211121]
P19  61300211121  [61300211121]
P20  61300211121  [61300211121]
P21  61300211121  [61300211121]
P22  61300211121  [61300211121]
Q1  MMBT2222A  [MMBT-SOT23]
R6  10 Ohm, 1/8 W  [RESISTOR_0805]
R7  1 KOhm, 1/8 W  [RESISTOR_0805]

### Blocks framed on the sheet
BLDC Motor: P11
Servo Motor: C41 C42 P12
Light Control: P13 Q1 R6 R7
Battery Tracking: C37-C40 P14
Backup Pin: P15-P22

### Ports
BLDC_MOTOR1 (bidir), BLDC_MOTOR2 (bidir), IBAT1 (bidir), IBAT2 (bidir), LIGHT (bidir), SERVO_MOTOR1 (bidir), SERVO_MOTOR2 (bidir), VBAT1 (bidir), VBAT2 (bidir)

### Nets
+5: C41.2 C42.2 P12.3
+12: R6.2
AGND: C37.2 C38.2 C39.1 C40.1
GND: C41.1 C42.1 P11.1 P12.1 Q1.3(E)
BLDC_MOTOR: P11.2 P15.2 P17.1
IBAT: C37.1 C38.1 P14.2 P16.2 P18.1
SERVO_MOTOR: P12.2 P19.2 P21.1
VBAT: C39.2 C40.2 P14.1 P20.2 P22.1
NetP13_1: P13.1 R6.1
NetP13_2: P13.2 Q1.2(C)
NetP15_1: P15.1 ; port BLDC_MOTOR1
NetP16_1: P16.1 ; port IBAT1
NetP17_2: P17.2 ; port BLDC_MOTOR2
NetP18_2: P18.2 ; port IBAT2
NetP19_1: P19.1 ; port SERVO_MOTOR1
NetP20_1: P20.1 ; port VBAT1
NetP21_2: P21.2 ; port SERVO_MOTOR2
NetP22_2: P22.2 ; port VBAT2
NetQ1_1: Q1.1(B) R7.2
NetR7_1: R7.1 ; port LIGHT

### Notes on the sheet
- (near *?#7) BFMC 2024 - The Newbie
- BFMC_ProcessingAllBoard
- Variant:
- Checked by
- Designed by BitterSweet
- (in symbol 01120610510) +
- (in symbol 01120610610) +
- (in symbol SDTitleBlock) Title:; Page Contents:; Revision:; Size:; DWG NO; Date:; Sheet; of

### Library data of the parts
C37 C39 = 0106031061010: CAP, size 0603, 10 nF, 10 VDC; Manufacture Name: Samsung Electro-Mechanics; Manufacture SN: CL10A106KP8NNWC; Capacitance: 10 nF; Tolerance: +/-10%; Voltage Rating DC: 10 VDC; ComponentLink2Description: Datasheet; ComponentLink2URL: https://www.mouser.vn/datasheet/2/585/MLCC-1837944.pdf; Operating Temperature: -55 to +125degC; Packaging: Tape and Reel; Mounting Technology: SMT; Size: 0603; Supplier 1 Name: Mouser; Supplier 1 SN: 187-CL10A106KP8NNWC; Supplier 1 URL: https://www.mouser.vn/ProductDetail/Samsung-Electro-Mechanics/CL10A106KP8NNWC?qs=xZ%2FP%252Ba9zWqZx8LSX23YqWA%3D%3D&utm_source=mouser-refine-download&utm_medium=file&utm_campaign=CL10A106KP8NNWC&utm_content=Samsung-Electro-Mechanics; Supplier 2 Name: Digi-Key; Supplier 2 SN: 1276-CL10A106KP8NNWCTR-ND; Supplier 2 URL: https://www.digikey.com/en/products/detail/samsung-electro-mechanics/cl10a106kp8nnwc/16572907; Supplier 3 Name: thegioiic; Supplier 3 SN: N/A; Supplier 3 URL: https://www.thegioiic.com/tu-gom-0603-10uf-25v; Value: 10 nF, 10 VDC; ComponentLink3Description: JLCPCB Link; ComponentLink3URL: https://jlcpcb.com/partdetail/Walsin_TechCorp-0603X106K100/C90806; JLCPCB Part: C90806
C38 C40 = 0106031051016: CAP, size 0603, 1 uF, 16 VDC; Manufacture Name: Samsung Electro-Mechanics; Manufacture SN: CL10B105KO8NNWC; Capacitance: 1 uF; Tolerance: +/-10%; Voltage Rating DC: 16 VDC; ComponentLink2Description: Datasheet; ComponentLink2URL: https://www.mouser.vn/datasheet/2/585/Samsung_MLCC_1837944-1929650.pdf; Operating Temperature: -55 to +125degC; Packaging: Tape and Reel; Mounting Technology: SMT; Size: 0603; Supplier 1 Name: Mouser; Supplier 1 SN: 187-CL10B105KO8NNWC; Supplier 1 URL: https://www.mouser.vn/ProductDetail/Samsung-Electro-Mechanics/CL10B105KO8NNWC?qs=81r%252BiQLm7BT%252BXtc72qn1ug%3D%3D&utm_source=mouser-refine-download&utm_medium=file&utm_campaign=CL10B105KO8NNWC&utm_content=Samsung-Electro-Mechanics; Supplier 2 Name: Digi-Key; Supplier 2 SN: 1276-CL10B105KO8NNWCTR-ND; Supplier 2 URL: https://www.digikey.com/en/products/detail/samsung-electro-mechanics/cl10b105ko8nnwc/16572783; Supplier 3 Name: thegioiic; Supplier 3 SN: N/A; Supplier 3 URL: https://www.thegioiic.com/tu-gom-0603-1uf-16v; Value: 1 uF, 16 VDC
C41 = 01120610610: CAP TANT 10uF 10% 16V 1206; Manufacture  Name: KYOCERA AVX; Manufacture  SN: TPSA106K016R1000; Capacitance Tolerance: +/-10%; ComponentLink1Description: Datasheet link; ComponentLink1URL: https://datasheets.kyocera-avx.com/TAJ.pdf; ComponentLink2Description: Supplier 1 URL; ComponentLink2URL: https://www.mouser.vn/ProductDetail/KYOCERA-AVX/TPSA106K016R1000?qs=GLv2FRWg8zkKT7IxHlCjvQ%3D%3D; Size: 1206; Mounting Technology: SMT; Capacitance: 10uF; ComponentLink3Description: Supplier 2 URL; ComponentLink3URL: https://www.digikey.com/en/products/detail/kyocera-avx/TPSA106K016R1000/7536120; ComponentLink4Description: Supplier 3 URL; ComponentLink4URL: https://www.thegioiic.com/tu-tantalum-10uf-16v-1206-taja106k016rnj; Supplier 1 Name: Mouser; Supplier 1 SN: 581-TPSA106K016R1000; Supplier 1 URL: https://www.mouser.vn/ProductDetail/KYOCERA-AVX/TPSA106K016R1000?qs=GLv2FRWg8zkKT7IxHlCjvQ%3D%3D; Supplier 2 Name: Digi-Key; Supplier 2 SN: 478-10757-1-ND; Supplier 2 URL: https://www.digikey.com/en/products/detail/kyocera-avx/TPSA106K016R1000/7536120; Supplier 3 Name: thegioiic; Supplier 3 SN: N/A; Supplier 3 URL: https://www.thegioiic.com/tu-tantalum-10uf-16v-1206-taja106k016rnj; Value: 10 µF, 16 V; Rated Voltage: 16 V
C42 = 01120610510: CAP TANT 1uF 10% 16V 1206; Manufacture  Name: KYOCERA AVX; Manufacture  SN: TAJA105K016RNJ; Capacitance Tolerance: +/-10%; ComponentLink1Description: Datasheet link; ComponentLink1URL: https://datasheets.kyocera-avx.com/TAJ.pdf; ComponentLink2Description: Supplier 1 URL; ComponentLink2URL: https://www.mouser.vn/ProductDetail/KYOCERA-AVX/TAJA105K016RNJ?qs=OVpPYgiJXXWzOIbDvQCr4Q%3D%3D; Size: 1206; Mounting Technology: SMT; Capacitance: 1uF; ComponentLink3Description: Supplier 2 URL; ComponentLink3URL: https://www.digikey.com/en/products/detail/kyocera-avx/TAJA105K016RNJ/563757; ComponentLink4Description: Supplier 3 URL; ComponentLink4URL: https://www.thegioiic.com/tu-tantalum-1uf-16v-1206-taja105k016rnj; Supplier 1 Name: Mouser; Supplier 1 SN: 581-TAJA105K016; Supplier 1 URL: https://www.mouser.vn/ProductDetail/KYOCERA-AVX/TAJA105K016RNJ?qs=OVpPYgiJXXWzOIbDvQCr4Q%3D%3D; Supplier 2 Name: Digi-Key; Supplier 2 SN: 478-1649-1-ND; Supplier 2 URL: https://www.digikey.com/en/products/detail/kyocera-avx/TAJA105K016RNJ/563757; Supplier 3 Name: thegioiic; Supplier 3 SN: N/A; Supplier 3 URL: https://www.thegioiic.com/tu-tantalum-1uf-16v-1206-taja105k016rnj; Value: 1 µF, 16 V; Rated Voltage: 16 V
P11 P14 = 620102131822: WR-WTB SMT Male Horizontal Shrouded Header, pitch 2mm, 2p; Pin Number: 2; Contact Resistance: 20mOhm; Withstanding Voltage: 800VAC; Working Voltage: 100VAC; ComponentLink1Description: Manufacturer; ComponentLink1URL: http://www.we-online.de; ComponentLink2Description: Datasheet; ComponentLink2URL: https://www.we-online.com/catalog/datasheet/620102131822.pdf; Pitch: 2mm; Published Date: January 2020; Publisher: Wurth Elektronik; Mounting Technology: SMT; Packaging: Tape and Reel; Operating Temperature: -25 to +85degC; Part Number: 620102131822; Gender: Male; Type: Horizontal; Rated Current: 2A; ComponentLink3Description: Global Supply; ComponentLink3URL: https://www.we-online.com/en/components/products/WTB_2_00_SMT_MALE_HORIZONTAL_SHROUDED_HEADER_6201XX131822?sq=620102131822#620102131822; ComponentLink4Description: Global Supply; ComponentLink4URL: https://www.mouser.vn/ProductDetail/Wurth-Elektronik/620102131822?qs=ZtY9WdtwX54K2dkLvxjzuQ%3D%3D; Supplier 1 Name: Mouser; Supplier 1 SN: 710-620102131822; Supplier 1 URL: https://www.mouser.vn/ProductDetail/Wurth-Elektronik/620102131822?qs=ZtY9WdtwX54K2dkLvxjzuQ%3D%3D; Supplier 2 Name: Digi-Key; Supplier 2 SN: N/A; Supplier 2 URL: N/A; Supplier 3 Name: thegioiic; Supplier 3 SN: N/A; Supplier 3 URL: https://www.thegioiic.com/dau-ph2-0mm-2-chan-dan-smd-nam-ngang; Value: 2A, 125V(AC)
P12 = 620103131822: WR-WTB SMT Male Horizontal Shrouded Header, pitch 2mm, 3p; Pin Number: 3; Contact Resistance: 20mOhm; Withstanding Voltage: 800VAC; Working Voltage: 100VAC; ComponentLink1Description: Manufacturer; ComponentLink1URL: http://www.we-online.de; ComponentLink2Description: Datasheet; ComponentLink2URL: https://www.we-online.com/catalog/datasheet/620103131822.pdf; Pitch: 2mm; Published Date: January 2020; Publisher: Wurth Elektronik; Mounting Technology: SMT; Packaging: Tape and Reel; Operating Temperature: -25 to +85degC; Part Number: 620103131822; Gender: Male; Type: Horizontal; Rated Current: 2A; ComponentLink3Description: Global Supply; ComponentLink3URL: https://www.we-online.com/en/components/products/WTB_2_00_SMT_MALE_HORIZONTAL_SHROUDED_HEADER_6201XX131822?sq=620103131822#620103131822; ComponentLink4Description: Global Supply; ComponentLink4URL: https://www.mouser.vn/ProductDetail/Wurth-Elektronik/620103131822?qs=ZtY9WdtwX54jBicvPVEzcw%3D%3D; Supplier 1 Name: Mouser; Supplier 1 SN: 710-620103131822; Supplier 1 URL: https://www.mouser.vn/ProductDetail/Wurth-Elektronik/620103131822?qs=ZtY9WdtwX54jBicvPVEzcw%3D%3D; Supplier 2 Name: Digi-Key; Supplier 2 SN: N/A; Supplier 3 Name: thegioiic; Supplier 3 SN: N/A; Supplier 3 URL: https://www.thegioiic.com/dau-ph2-0mm-3-chan-dan-smd-nam-ngang; Value: 2A, 125V(AC)
P13 = 620302124022: WR-WTB SMT Male Vertical Shrouded Header, pitch 2mm, 2p; Pin Number: 2; Contact Resistance: 20mOhm; Withstanding Voltage: 800VAC; Working Voltage: 100VAC; ComponentLink1Description: Manufacturer; ComponentLink1URL: http://www.we-online.de; ComponentLink2Description: Datasheet; ComponentLink2URL: https://www.we-online.com/catalog/datasheet/620302124022.pdf; Pitch: 2mm; Published Date: January 2020; Publisher: Wurth Elektronik; Mounting Technology: SMT; Packaging: Tape and Reel; Operating Temperature: -25 to +85degC; Part Number: 620302124022; Gender: Male; Type: Vertical; Rated Current: 2A; ComponentLink3Description: Global Supply; ComponentLink3URL: https://www.we-online.com/en/components/products/WTB_2_00_SMT_MALE_VERTICAL_SHROUDED_HEADER_6203XX124022?sq=620302124022#620302124022; ComponentLink4Description: Global Supply; ComponentLink4URL: https://www.mouser.vn/ProductDetail/Wurth-Elektronik/620302124022?qs=ZtY9WdtwX56bKCHoSxh6%252Bg%3D%3D; Supplier 1 Name: Mouser; Supplier 1 SN: 710-620302124022; Supplier 1 URL: https://www.mouser.vn/ProductDetail/Wurth-Elektronik/620302124022?qs=ZtY9WdtwX56bKCHoSxh6%252Bg%3D%3D; Supplier 2 Name: Digi-Key; Supplier 2 SN: N/A; Supplier 2 URL: N/A; Supplier 3 Name: thegioiic; Supplier 3 SN: N/A; Supplier 3 URL: https://www.thegioiic.com/dau-hy2-0mm-2-chan-dan-smd-thang-dung; Value: 2A, 125V(AC)
P15-P22 = 61300211121: WR-PHD Pin Header, THT, pitch 2.54mm, Single Row, Vertical, 2p; Manufacturer: Wurth Elektronik; Pin Number: 2; Rated Current: 3A; Working Voltage: 250VAC; Withstanding Voltage: 500VAC; Contact Resistance: 20mOhm; Supply Name 1: Mouser; ComponentLink1Description: Manufacturer; ComponentLink1URL: http://www.we-online.de; ComponentLink2Description: Datasheet; ComponentLink2URL: https://www.we-online.com/catalog/datasheet/61300211121.pdf; Manufacturer Part Number: 61300211121; Published Date: May 2020; Pitch: 2.54mm; Operating Temperature: -40 to +105degC; Mounting Technology: THT; Packaging: Bag; Gender: Pin Header; Row Number: Single; Orientation: Vertical; ComponentLink3Description: Global Supply; ComponentLink3URL: https://www.mouser.vn/ProductDetail/Wurth-Elektronik/61300211121?qs=t4813l51qx%252B1A5GYDQxPlw%3D%3D; Supplier 1 Name: Mouser; Supplier 1 SN: 710-61300211121; Supplier 1 URL: https://www.mouser.vn/ProductDetail/Wurth-Elektronik/61300211121?qs=t4813l51qx%252B1A5GYDQxPlw%3D%3D; Supplier 2 Name: Digi-Key; Supplier 2 SN: N/A; Supplier 2 URL: N/A; Supplier 3 Name: thegioiic; Supplier 3 SN: N/A; Supplier 3 URL: N/A
Q1 = MMBT2222A: TRANS NPN, 40V, 600MA, SOT23-3; DC Current Gain: 35-300; Gain Bandwidth Product fT: 250MHz; Power Dissipation: 250mW; Current - Collector: 600mA; Package: SOT-23; Supplier 1 Name: Mouser; Supplier 1 SN: 637-MMBT2222A; Supplier 1 URL: https://www.mouser.vn/ProductDetail/Diotec-Semiconductor/MMBT2222A?qs=OlC7AqGiEDl9N1c3%252BL%2F%252Brw%3D%3D; Supplier 2 Name: Digi-Key; Supplier 2 SN: 2796-MMBT2222ATR-ND; Supplier 2 URL: https://www.digikey.com/en/products/detail/diotec-semiconductor/MMBT2222A/13163394; Supplier 3 Name: thegioiic; Supplier 3 URL: https://www.thegioiic.com/mmbt2222a-transistor-npn-40v-0-6a-3-chan-sot-23; Transistor Type: NPN; Voltage - Collector Emitter Breakdown: 40V; Supplier 3 SN: N/A; Value: MMBT2222A
R6 = 0008051001: RES, size 0805, 10 Ohm, 1/8 W; Manufacture  Name: Vishay Dale Thin Film; Manufacture  SN: M55342H06B10D0RT5; Resistance tolerance: +/-1%; Rated Power: 1/8 W; Resistance: 10 Ohm; Size: 0805; Mounting Technology: SMT; Supplier 1 Name: Mouser; Supplier 1 SN: 71-CRCW080510R0FKEAH; Supplier 1 URL: https://www.mouser.vn/ProductDetail/Vishay-Dale/CRCW080510R0FKEAHP?qs=sGAEpiMZZMtlubZbdhIBIB2QTI7Ai3Wq221SUXRDybo%3D; Supplier 2 Name: Digi-Key; Supplier 2 SN: 764-M55342H06B10D0RT5TR-ND; Supplier 2 URL: https://www.digikey.com/en/products/detail/vishay-dale-thin-film/M55342H06B10D0RT5/3580812; Supplier 3 Name: Thegioiic; Supplier 3 SN: N/A; Supplier 3 URL: https://www.thegioiic.com/dien-tro-10-ohm-0805-1-; Value: 10 Ohm, 1/8 W; ComponentLink1Description: Datasheet link; ComponentLink1URL: https://www.vishay.com/docs/60018/eh.pdf; ComponentLink2Description: Supplier 1 URL; ComponentLink2URL: https://www.mouser.vn/ProductDetail/Vishay-Dale/CRCW080510R0FKEAHP?qs=sGAEpiMZZMtlubZbdhIBIB2QTI7Ai3Wq221SUXRDybo%3D; ComponentLink3Description: Supplier 2 URL; ComponentLink3URL: https://www.digikey.com/en/products/detail/vishay-dale-thin-film/M55342H06B10D0RT5/3580812; ComponentLink4Description: Supplier 3 URL; ComponentLink4URL: https://www.thegioiic.com/dien-tro-10-ohm-0805-1-
R7 = 0008051025: RES, size 0805, 1 KOhm, 1/8 W; Manufacture  Name: Vishay Dale; Manufacture  SN: CRCW08051K00JNEAC; Resistance tolerance: +/-5%; Rated Power: 1/8 W; Resistance: 1 KOhm; Size: 0805; Mounting Technology: SMT; Supplier 1 Name: Mouser; Supplier 1 SN: 71-CRCW08051K00JNEC; Supplier 1 URL: https://www.mouser.vn/ProductDetail/Vishay-Dale/CRCW08051K00JNEC?qs=OW6ROCK%252BaiZqKFsNe9zjFw%3D%3D; Supplier 2 Name: Digi-Key; Supplier 2 SN: 541-4162-2-ND; Supplier 2 URL: https://www.digikey.com/en/products/detail/vishay-dale/CRCW08051K00JNEAC/7928584; Supplier 3 Name: Thegioiic; Supplier 3 SN: N/A; Supplier 3 URL: https://www.thegioiic.com/dien-tro-1-kohm-0805-5-; Value: 1 KOhm, 1/8 W; ComponentLink1Description: Datasheet link; ComponentLink1URL: https://www.vishay.com/docs/28773/crcwce3.pdf; ComponentLink2Description: Supplier 1 URL; ComponentLink2URL: https://www.mouser.vn/ProductDetail/Vishay-Dale/CRCW08051K00JNEC?qs=OW6ROCK%252BaiZqKFsNe9zjFw%3D%3D; ComponentLink3Description: Supplier 2 URL; ComponentLink3URL: https://www.digikey.com/en/products/detail/vishay-dale/CRCW08051K00JNEAC/7928584; ComponentLink4Description: Supplier 3 URL; ComponentLink4URL: https://www.thegioiic.com/dien-tro-1-kohm-0805-5-